# Altium schematic sheet for_BLDC_fan.SchDoc
size A4
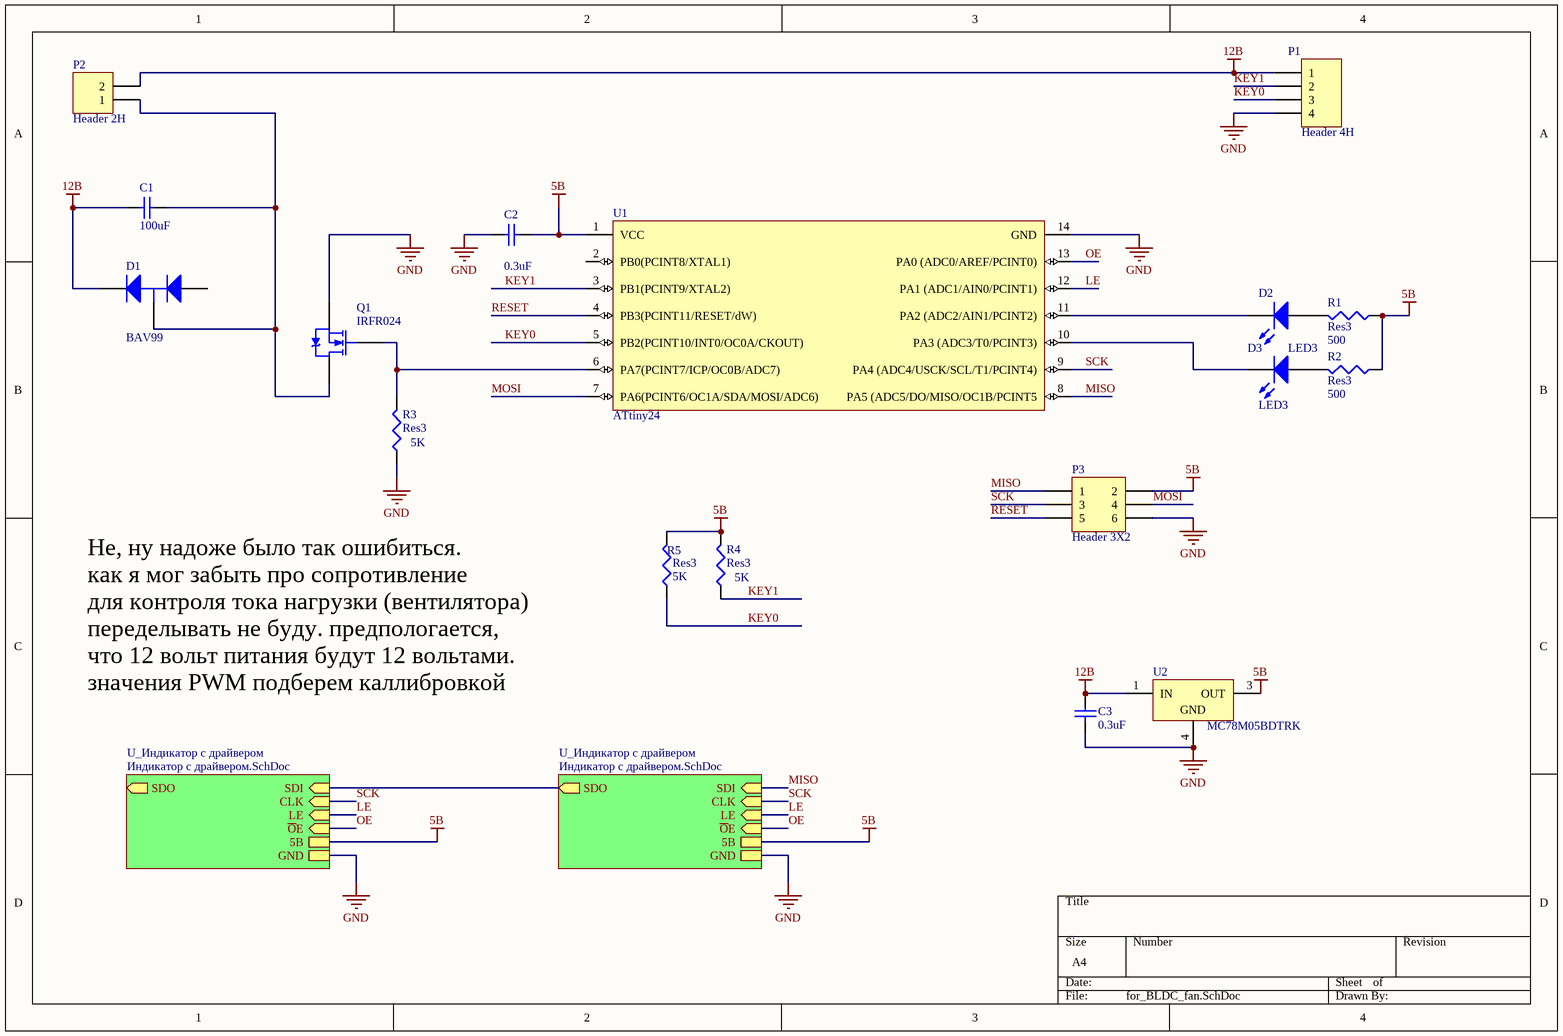
[diagram p0: for_BLDC_fan.SchDoc]

## Parts
C1  value 100uF  [CAPC1608L]  (hidden comment: Cap Semi)
C2  value 0.3uF  [CAPC1608L]  (hidden comment: Cap Semi)
C3  value 0.3uF  [CAPC1608L]  (hidden comment: Cap Semi)
D1  BAV99  [SOT-23]
D2  LED3  [DSO-C2/D5.6]
D3  LED3  [DSO-C2/D5.6]
P1  Header 4H  [HDR1X4H]
P2  Header 2H  [HDR1X2H]
P3  Header 3X2  [HDR2X3]
Q1  IRFR024  [TO-252AA]
R1  Res3  value 500  [RESC1608L]
R2  Res3  value 500  [RESC1608L]
R3  Res3  value 5K  [RESC1608L]
R4  Res3  value 5K  [RESC1608L]
R5  Res3  value 5K  [RESC1608L]
U1  ATtiny24  [SOIC14_M]
U2  MC78M05BDTRK  [369A-13]

## Sub-sheets
U_Индикатор с драйвером = Индикатор с драйвером.SchDoc: GND, ~{O}E (in), LE (in), CLK (in), SDI (in), 5В, SDO (out)
U_Индикатор с драйвером = Индикатор с драйвером.SchDoc: GND, ~{O}E (in), LE (in), CLK (in), SDI (in), 5В, SDO (out)

## Nets
5В: C2.2 P3.2 R1.1 R2.1 R4.2 R5.2 U1.1(VCC) U2.3(OUT) ; sheet U_Индикатор с драйвером/5В, sheet U_Индикатор с драйвером/5В
12B: C1.2 C3.2 D1.2(K) P1.1 P2.2 U2.1(IN)
GND: C2.1 C3.1 P1.4 P3.6 Q1.3(S) R3.1 U1.14(GND) U2.4(GND) ; sheet U_Индикатор с драйвером/GND, sheet U_Индикатор с драйвером/GND
KEY0: P1.3 R5.1 U1.5(PB2(PCINT10/INT0/OC0A/CKOUT))
KEY1: P1.2 R4.1 U1.3(PB1(PCINT9/XTAL2))
LE: U1.12(PA1_(ADC1/AIN0/PCINT1)) ; sheet U_Индикатор с драйвером/LE, sheet U_Индикатор с драйвером/LE
MISO: P3.1 U1.8(PA5_(ADC5/DO/MISO/OC1B/PCINT5) ; sheet U_Индикатор с драйвером/SDI
MOSI: P3.4 U1.7(PA6(PCINT6/OC1A/SDA/MOSI/ADC6))
OE: U1.13(PA0_(ADC0/AREF/PCINT0)) ; sheet U_Индикатор с драйвером/~{O}E, sheet U_Индикатор с драйвером/~{O}E
RESET: P3.5 U1.4(PB3(PCINT11/RESET/dW))
SCK: P3.3 U1.9(PA4_(ADC4/USCK/SCL/T1/PCINT4)) ; sheet U_Индикатор с драйвером/CLK, sheet U_Индикатор с драйвером/CLK
NetC1_1: C1.1 D1.3(C) P2.1 Q1.4(D)
NetD2_1: D2.1(A) R1.2
NetD2_2: D2.2(K) U1.11(PA2_(ADC2/AIN1/PCINT2))
NetD3_1: D3.1(A) R2.2
NetD3_2: D3.2(K) U1.10(PA3_(ADC3/T0/PCINT3))
NetQ1_1: Q1.1(G) R3.2 U1.6(PA7(PCINT7/ICP/OC0B/ADC7))
(unnamed): sheet U_Индикатор с драйвером/SDI, sheet U_Индикатор с драйвером/SDO

Not connected (* = marked no-connect by the designer): D1 1(A); U1 2(PB0(PCINT8/XTAL1))

## Notes on the sheet
- Не, ну надоже было так ошибиться.
  как я мог забыть про сопротивление
  для контроля тока нагрузки (вентилятора)
  переделывать не буду. предпологается,
  что 12 вольт питания будут 12 вольтами.
  значения PWM подберем каллибровкой

## Library data of the parts
C1-C3 = Cap Semi: Capacitor (Semiconductor SIM Model); Published: 8-Jun-2000; LatestRevisionDate: 29-May-2009; LatestRevisionNote: IPC-7351 Footprint Added.; PackageReference: C1206; Publisher: Altium Limited; PackageDescription: Chip Capacitor
D1 = BAV99: Silicon Switching Diode Array for High-Speed Switching; Published: 21-Mar-2003; DatasheetDocument: Oct-1999; PackageDocument: Sep-2001; PackageReference: SOT-23; Publisher: Altium Limited; ComponentLink1Description: Manufacturer Link; ComponentLink1URL: http://www.infineon.com/; ComponentLink2Description: Datasheet; ComponentLink2URL: http://www.infineon.com/upload/Document/cmc_upload/documents/080/631/bav99series_1.pdf
D2 D3 = LED3: Typical BLUE SiC LED; Published: 8-Jun-2000; LatestRevisionDate: 17-Dec-2003; LatestRevisionNote: PCB Footprint replaced.; DatasheetVersion: 16-Apr-2002; PackageVersion: 16-Apr-2002; PackageReference: 3.5X2.8X1.9; Publisher: Altium Limited
P1 = Header 4H: Header, 4-Pin, Right Angle; LatestRevisionDate: 17-Jul-2002; LatestRevisionNote: Re-released for DXP Platform.; Publisher: Altium Limited
P2 = Header 2H: Header, 2-Pin, Right Angle; LatestRevisionDate: 17-Jul-2002; LatestRevisionNote: Re-released for DXP Platform.; Publisher: Altium Limited
P3 = Header 3X2: Header, 3-Pin, Dual row; LatestRevisionDate: 17-Jul-2002; LatestRevisionNote: Re-released for DXP Platform.; Publisher: Altium Limited
Q1 = IRFR024: HEXFET N-Channel Power MOSFET; Note: Pin 2 is trimmed and is electrically connected to Drain.; Published: 8-Jun-2000; LatestRevisionDate: 17-Jul-2002; LatestRevisionNote: Re-released for DXP Platform.; DatasheetVersion: PD-9.702A; PackageVersion: Feb-2003; PackageReference: TO-252AA; Publisher: Altium Limited; PackageDescription: D-PAK/TO-252-AA; 3 Leads (1 Cropped); Body 10.4 (inc. leads) x 6.7 mm (LxW max); Code_JEDEC: TO-252-AA; ComponentLink1Description: Manufacturer Link; ComponentLink1URL: http://www.irf.com/; ComponentLink2Description: Datasheet; ComponentLink2URL: http://www.irf.com/product-info/datasheets/data/irfr024.pdf
R1-R5 = Res3: Resistor; Published: 8-Jun-2000; LatestRevisionDate: 29-May-2009; LatestRevisionNote: IPC-7351 Footprint Added.; PackageReference: J1-0603; Publisher: Altium Limited; PackageDescription: Chip Resistor
U1 = ATtiny24: 8-Bit AVR Microcontroller with 1K Byte of Flash Memory; Published: 17-Sep-2003; LatestRevisionDate: 13-Apr-2006; LatestRevisionNote: IPC-7351 Footprint Added.; DatasheetVersion: 1187E-AVR-06/02; PackageVersion: revB, May-2002; PackageReference: 8S2; Publisher: Altium Limited; PackageDescription: 8-Pin Small Outline Package 1.27 mm Pitch; ComponentLink1Description: Manufacturer Link; ComponentLink1URL: http://www.atmel.com; ComponentLink2Description: Datasheet; ComponentLink2URL: http://www.atmel.com/dyn/resources/prod_documents/doc1187.pdf
U2 = MC78M05BDTRK: Three-Terminal Medium Current Positive Voltage Regulator; Note: Pin 2 is electrically connected to Pin 4; Pin 2 is trimmed and not drawn;; Published: 15-Apr-2002; DatasheetVersion: Apr-2000; PackageVersion: 1997; PackageReference: 369A-13; Publisher: Altium Limited; PackageDescription: D-PAK/TO-252-AA; 3 Leads (1 Cropped); Body 10.3 (inc. leads) x 6.7 mm (LxW max); ComponentLink1Description: Manufacturer Link; ComponentLink1URL: http://www.onsemi.com/site/products/taxonomy/0,4438,503,00.html; ComponentLink2Description: Datasheet; ComponentLink2URL: http://www.onsemi.com/pub/Collateral/MC78M00-D.PDF